# Altium schematic sheet Controller_Interface.SchDoc: Board Interfaces
size A4; DocumentNumber: 7; SheetNumber: 7; SheetTotal: 8
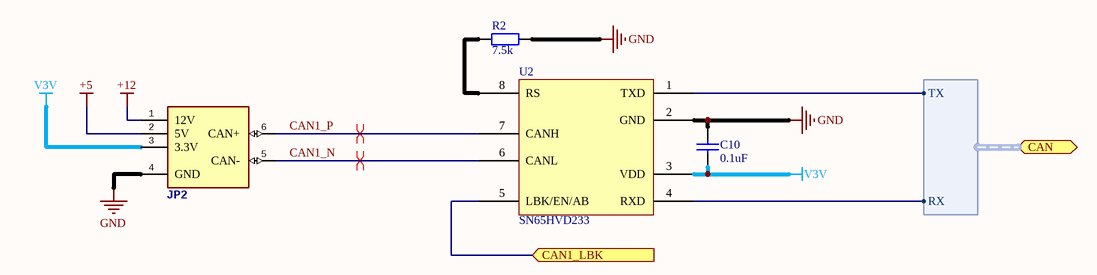
[diagram p0: Controller_Interface.SchDoc]

## Parts
C10  value 0.1uF  [CAPC1608X06N (0603)]  (hidden comment: Cap Semi)
JP2  JST PH Series, 2mm Pitch 6 Way 1 Row Right Angle PCB Header, Solder Termination, 2A   Source:  Datasheet  [S6B-PH-SM4-TB(LF)(SN)]  (value not drawn)
R2  value 7.5k  [RESC1608X06N (0603)]  (hidden comment: Res)
U2  SN65HVD233  [SOIC127P600X175-8N]

## Ports
CAN1_LBK (in), CAN (harness CAN_Harness)

## Harnesses
CAN_Harness: RX, TX

## Nets
+5: JP2.2(5V)
+12: JP2.1(12V)
GND: C10.2 JP2.4(GND) R2.2 U2.2(GND)
V3V: C10.1 JP2.3(3.3V) U2.3(VDD)
CAN1_LBK: U2.5(LBK/EN/AB) ; port CAN1_LBK
CAN1_N: JP2.5(CAN-) U2.6(CANL)
CAN1_P: JP2.6(CAN+) U2.7(CANH)
NetR2_1: R2.1 U2.8(RS)
NetU2_1: U2.1(TXD) ; port CAN.TX
NetU2_4: U2.4(RXD) ; port CAN.RX

## Layout directives
differential pair: CAN1_N, CAN1_P

## Notes on the sheet
- Title
- Size:
- Date:
- A4
- Number:
- Time:
- Revision:
- Sheet
- of
- File:

## Library data of the parts
C10 = Cap Semi: Capacitor (Semiconductor SIM Model); Published: 8-Jun-2000; LatestRevisionDate: 29-May-2009; LatestRevisionNote: IPC-7351 Footprint Added.; PackageReference: X7R; Publisher: Altium Limited; PackageDescription: Chip Capacitor
JP2 = miStepper-Connector: Custom header for miStepper; Manufacturer_Name: JST (JAPAN SOLDERLESS TERMINALS); Farnell_Part_Number: 9492658; Farnell_Price-Stock: http://uk.farnell.com/jsp/displayProduct.jsp?sku=9492658&action=view; Manufacturer_Part_Number: S6B-PH-SM4-TB(LF)(SN); Height: mm
R2 = Res: Resistor; Published: 8-Jun-2000; LatestRevisionDate: 17-Jul-2002; LatestRevisionNote: Re-released for DXP Platform.; PackageReference: MCWR06; Publisher: Altium Limited; PackageDescription: SMD Chip Resistor
U2 = SN65HVD23x: 3.3V CAN Bus Transceiver; Manufacturer: Texas Instruments